# EAGLE schematic TEMP-S2G (EAGLE 9.6.1)
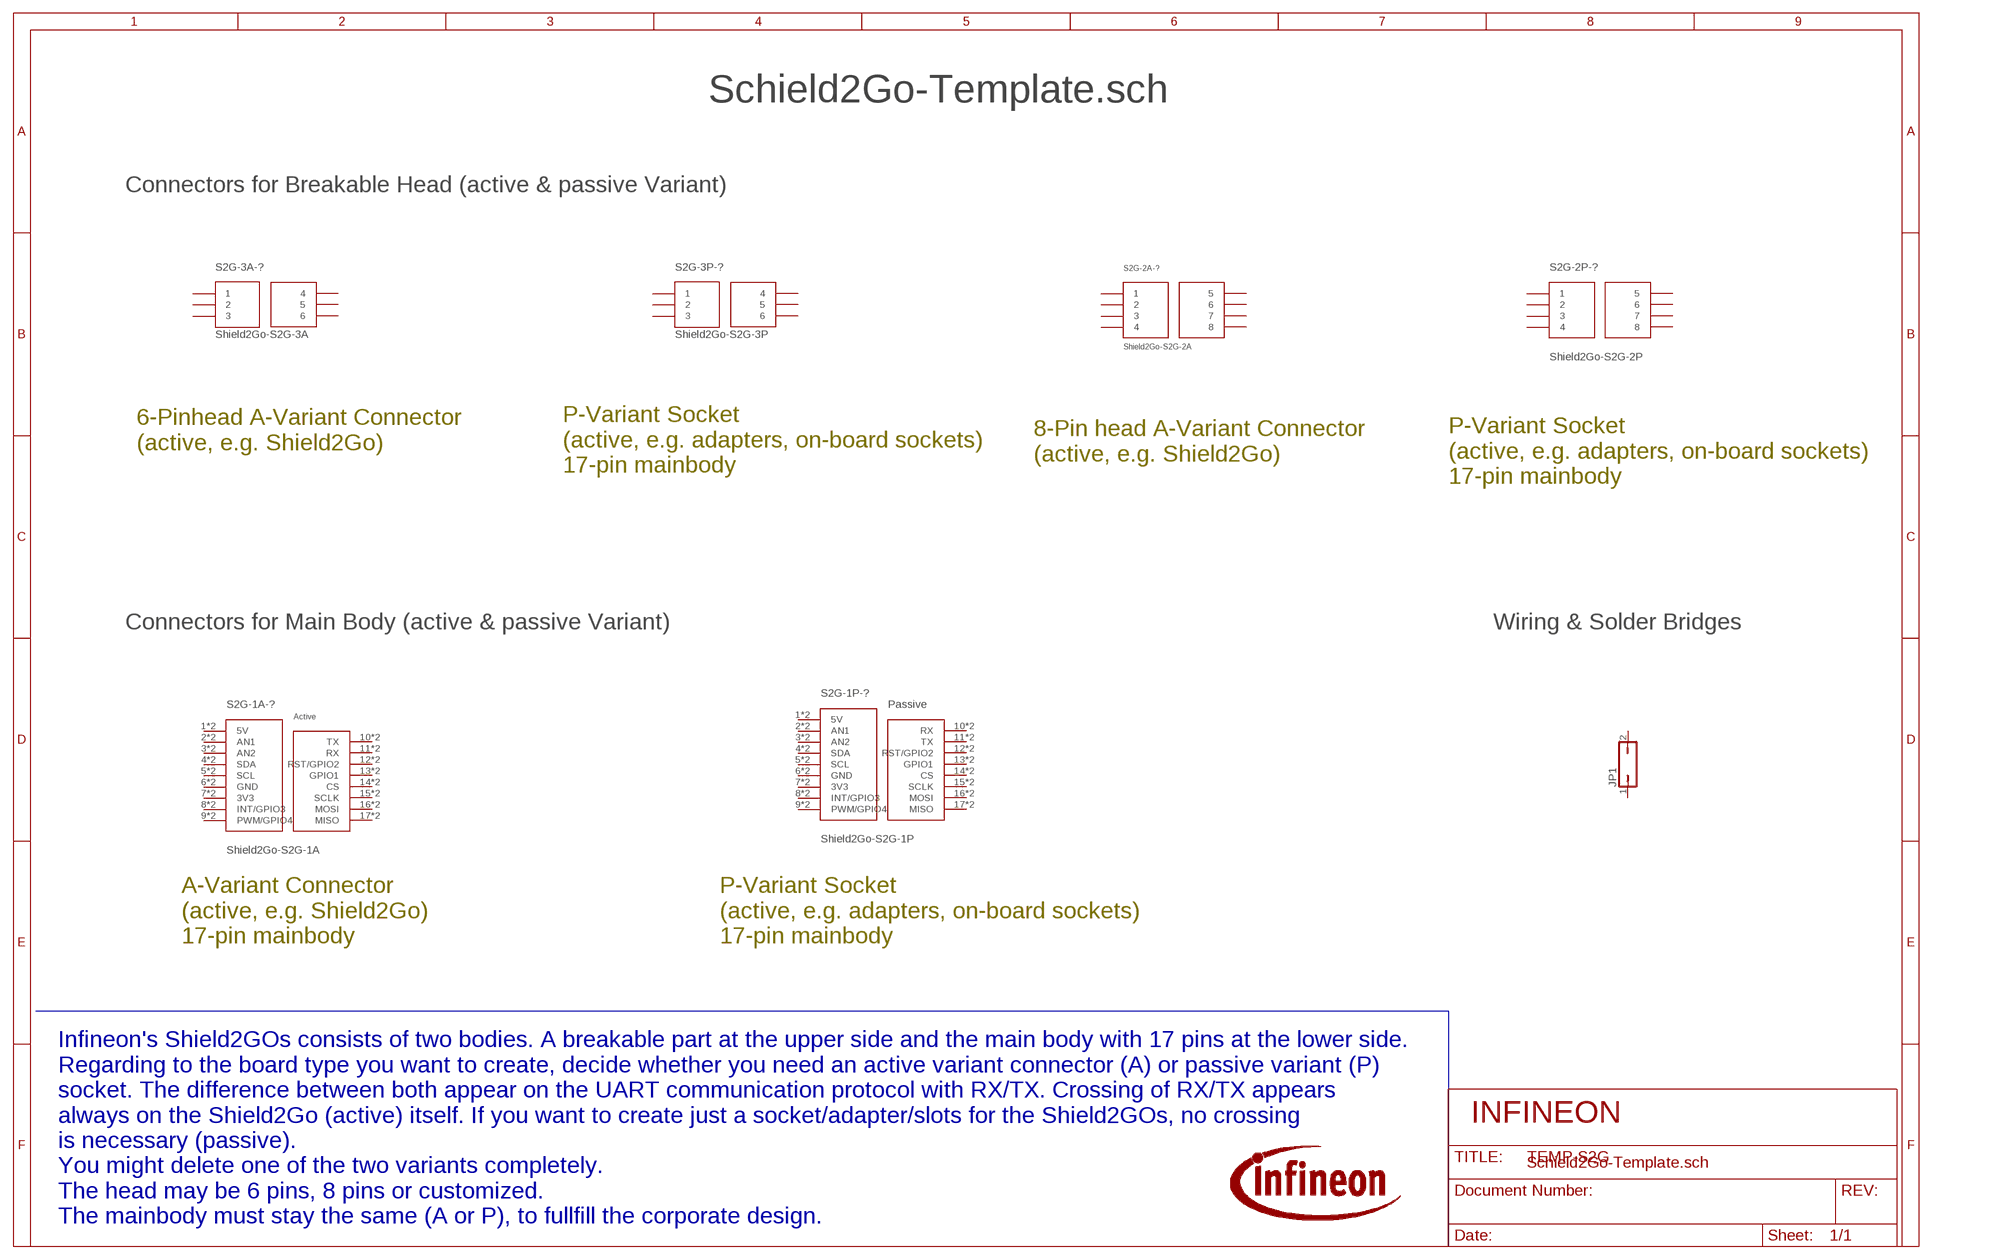
[diagram p0: schematic, sheet 1]

## Parts
JP1  JP1Q  [JP1]
U$1  6PIN  [6PIN]
U$2  BODY  [BODY]
U$3  6PIN-PP  [6PIN]
U$4  8PIN  [8PIN]
U$5  8PIN-PP  [8PIN]
U$6  BODY-P  [BODY-P]
Unconnected: JP1.1 JP1.2 U$1.1 U$1.2 U$1.3 U$1.4 U$1.5 U$1.6 U$1.P$1 U$1.P$2 U$1.P$3 U$1.P$4 U$1.P$5 U$1.P$6 U$2.1(5V) U$2.2(AN1) U$2.3(AN2) U$2.4(SDA) U$2.5(SCL) U$2.6(GND) U$2.7(3V3) U$2.8(INT/GPIO3) U$2.9(PWM/GPIO4) U$2.10(TX) U$2.11(RX) U$2.12(RST/GPIO2) U$2.13(GPIO1) U$2.14(CS) U$2.15(SCLK) U$2.16(MOSI) U$2.17(MISO) U$2.P$1(5V) U$2.P$2(AN1) U$2.P$3(AN2) U$2.P$4(SDA) U$2.P$5(SCL) U$2.P$6(GND) U$2.P$7(3V3) U$2.P$8(INT/GPIO3) U$2.P$9(PWM/GPIO4) U$2.P$10(TX) U$2.P$11(RX) U$2.P$12(RST/GPIO2) U$2.P$13(GPIO1) U$2.P$14(CS) U$2.P$15(SCLK) U$2.P$16(MOSI) U$2.P$17(MISO) U$3.1 U$3.2 U$3.3 U$3.4 U$3.5 U$3.6 U$3.P$1 U$3.P$2 U$3.P$3 U$3.P$4 U$3.P$5 U$3.P$6 U$4.1 U$4.2 U$4.3 U$4.4 U$4.5 U$4.6 U$4.7 U$4.8 U$4.P$1 U$4.P$2 U$4.P$3 U$4.P$4 U$4.P$5 U$4.P$6 U$4.P$7 U$4.P$8 U$5.1 U$5.2 U$5.3 U$5.4 U$5.5 U$5.6 U$5.7 U$5.8 U$5.P$1 U$5.P$2 U$5.P$3 U$5.P$4 U$5.P$5 U$5.P$6 U$5.P$7 U$5.P$8 U$6.1(5V) U$6.2(AN1) U$6.3(AN2) U$6.4(SDA) U$6.5(SCL) U$6.6(GND) U$6.7(3V3) U$6.8(INT/GPIO3) U$6.9(PWM/GPIO4) U$6.10(RX) U$6.11(TX) U$6.12(RST/GPIO2) U$6.13(GPIO1) U$6.14(CS) U$6.15(SCLK) U$6.16(MOSI) U$6.17(MISO) U$6.P$1(5V) U$6.P$2(AN1) U$6.P$3(AN2) U$6.P$4(SDA) U$6.P$5(SCL) U$6.P$6(GND) U$6.P$7(3V3) U$6.P$8(INT/GPIO3) U$6.P$9(PWM/GPIO4) U$6.P$10(RX) U$6.P$11(TX) U$6.P$12(RST/GPIO2) U$6.P$13(GPIO1) U$6.P$14(CS) U$6.P$15(SCLK) U$6.P$16(MOSI) U$6.P$17(MISO)

## Notes on the sheet
- Schield2Go-Template.sch
- Connectors for Breakable Head (active & passive Variant)
- 6-Pinhead A-Variant Connector 
  (active, e.g. Shield2Go)
- 8-Pin head A-Variant Connector
  (active, e.g. Shield2Go)
- P-Variant Socket
  (active, e.g. adapters, on-board sockets)
  17-pin mainbody
- P-Variant Socket
  (active, e.g. adapters, on-board sockets)
  17-pin mainbody
- Connectors for Main Body (active & passive Variant) | Wiring & Solder Bridges
- A-Variant Connector
  (active, e.g. Shield2Go)
  17-pin mainbody
- P-Variant Socket
  (active, e.g. adapters, on-board sockets)
  17-pin mainbody
- INFINEON
- Schield2Go-Template.sch
- Infineon's Shield2GOs consists of two bodies. A breakable part at the upper side and the main body with 17 pins at the lower side.
  Regarding to the board type you want to create, decide whether you need an active variant connector (A) or passive variant (P) 
  socket. The difference between both appear on the UART communication protocol with RX/TX. Crossing of RX/TX appears
  always on the Shield2Go (active) itself. If you want to create just a socket/adapter/slots for the Shield2GOs, no crossing
  is necessary (passive). 
  You might delete one of the two variants completely. 
  The head may be 6 pins, 8 pins or customized. 
  The mainbody must stay the same (A or P), to fullfill the corporate design.

## Library data of the parts
JP1 = jumper:JP1Q: JUMPER
U$1 = 6PIN:6PIN: 6 Pin Connector for Head of Shield2Go Boards
U$2 = BODY:BODY: 17 Pin Connector for Shield2Go Boards
U$3 = 6PIN:6PIN-P: 6 Pin Socket for Head of Shield2Go Boards
U$4 = 8PIN:8PIN: 8 Pin Connector for Head of Shield2Go Boards
U$5 = 8PIN:8PIN-P: 8 Pin Socket for Head of Shield2Go Boards
U$6 = BODY-P:BODY-P: 17 Pin Socket for Shield2Go Boards